# EAGLE design rectifier-monitoring-v2 (EAGLE 6.3)
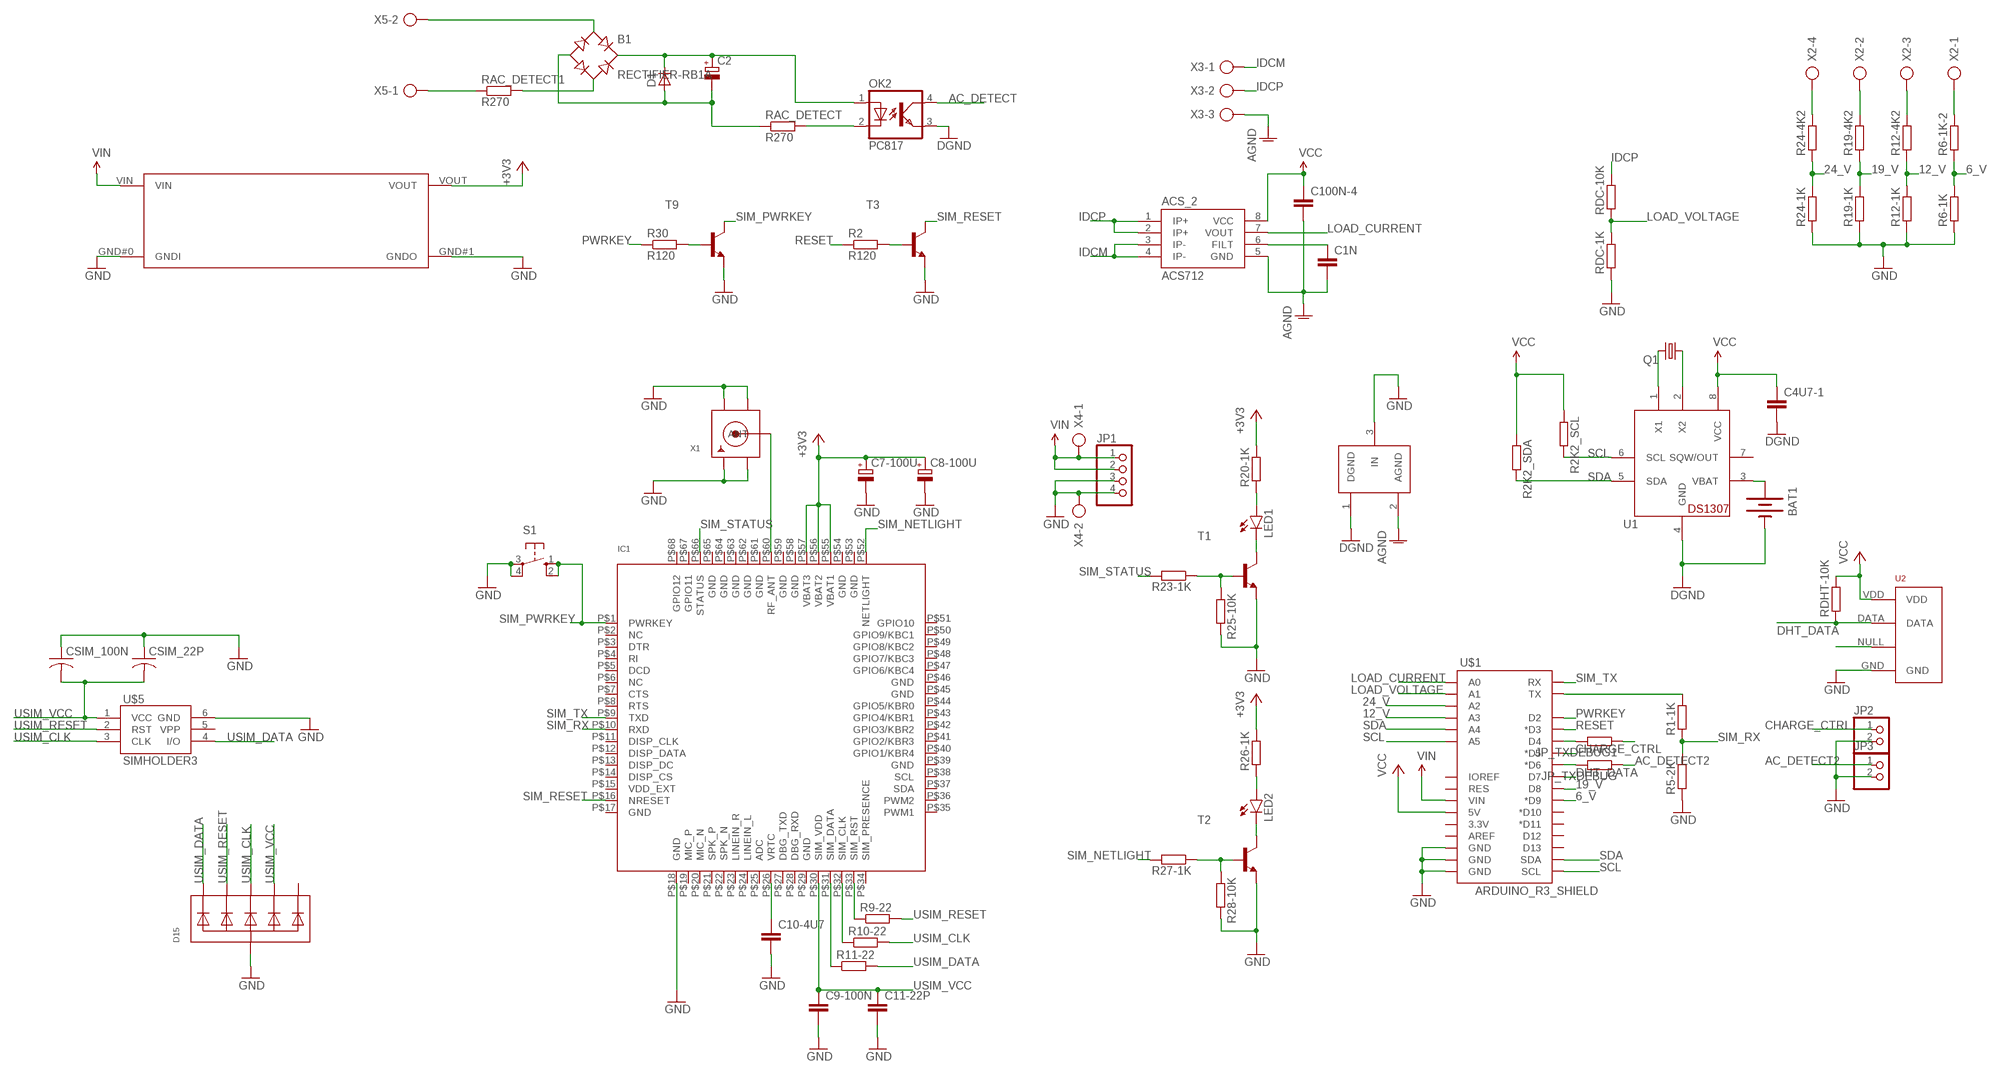
[diagram p0: schematic, sheet 1]

## Parts
ACS_2  ACS712  [SO08]
B1  RECTIFIER-RB1A  [RB1A]
BAT1  BATTERY20PTH  [BATTCOM_20MM_PTH]
C1N  C-EUC0603K  [C0603K]
C2  CPOL-EUE5-8.5  [E5-8,5]
C4U7-1  C-EUC0603K  [C0603K]
C7-100U  CPOL-EU153CLV-0605  [153CLV-0605]
C8-100U  CPOL-EU153CLV-0605  [153CLV-0605]
C9-100N  C-EUC0603  [C0603]
C10-4U7  C-EUC0603  [C0603]
C11-22P  C-EUC0603  [C0603]
C100N-4  C-EUC0603K  [C0603K]
CSIM_22P  C-USC0603K  [C0603K]
CSIM_100N  C-USC0603K  [C0603K]
D1  ZENER-DIODEZD-7.5  [ZDIO-7.5]
D15  TVSARRAY_5LANE  [SOT363]
IC1  GSM_SIM900_LITERAL  [SIM900_SMT]
JP1  PINHD-1X4  [1X04]
JP2  PINHD-1X2  [1X02]
JP3  PINHD-1X2  [1X02]
JP_TXDEBUG  R-EU_R0603  [R0603]
JP_TXDEBUG1  R-EU_R0603  [R0603]
LED1  LED-3MM-NO_SILK  [LED3MM-NS]
LED2  LED-3MM-NO_SILK  [LED3MM-NS]
OK2  PC817  [DIL04]
Q1  CRYSTALTC38H  [TC38H]
R1-1K  R-EU_R0603  [R0603]
R2  R120  R-EU_M0805  [M0805]
R2K2_SCL  R-EU_R0603  [R0603]
R2K2_SDA  R-EU_R0603  [R0603]
R5-2K  R-EU_R0603  [R0603]
R6-1K  R-EU_R0805  [R0805]
R6-1K-2  R-EU_R0805  [R0805]
R9-22  R-EU_R0603  [R0603]
R10-22  R-EU_R0603  [R0603]
R11-22  R-EU_R0603  [R0603]
R12-1K  R-EU_R0805  [R0805]
R12-4K2  R-EU_R0805  [R0805]
R19-1K  R-EU_R0805  [R0805]
R19-4K2  R-EU_R0805  [R0805]
R20-1K  R-EU_R0603  [R0603]
R23-1K  R-EU_R0603  [R0603]
R24-1K  R-EU_R0805  [R0805]
R24-4K2  R-EU_R0805  [R0805]
R25-10K  R-EU_R0603  [R0603]
R26-1K  R-EU_R0603  [R0603]
R27-1K  R-EU_R0603  [R0603]
R28-10K  R-EU_R0603  [R0603]
R30  R120  R-EU_M0805  [M0805]
RAC_DETECT  R270  R-EU_R0603  [R0603]
RAC_DETECT1  R270  R-EU_0207/10  [0207/10]
RDC-1K  R-EU_M0805  [M0805]
RDC-10K  R-EU_R0805  [R0805]
RDHT-10K  R-EU_R0603  [R0603]
S1  10-XX  [B3F-10XX]
T1  MMBT2222ALT1-NPN-SOT23-BEC  [SOT23-BEC]
T2  MMBT2222ALT1-NPN-SOT23-BEC  [SOT23-BEC]
T3  MMBT2222ALT1-NPN-SOT23-BEC  [SOT23-BEC]
T9  MMBT2222ALT1-NPN-SOT23-BEC  [SOT23-BEC]
U1  DS1307  [DIL08]
U2  RHT03_DHT-22_AM2302  [RHT03_DHT-22]
U$1  ARDUINO_R3_SHIELD  [UNO_R3_SHIELD]
U$2  DCDCMODULE  [DCDCMODULE]
U$3  GND_CONNECT  [GND_CONNECT]
U$5  SIMHOLDER3  [SIMHOLDER3]
X1  SMACONNECTOR  [SMA90_DIP]
X2  AK300/4  [AK300/4]
X3  AK300/3  [AK300/3]
X4  AK300/2  [AK300/2]
X5  AK300/2  [AK300/2]

## Nets
6_V: R6-1K-2.1 R6-1K.2 U$1.D9(*D9)
12_V: R12-1K.2 R12-4K2.1 U$1.A3
19_V: R19-1K.2 R19-4K2.1 U$1.D8
24_V: R24-1K.2 R24-4K2.1 U$1.A2
+3V3: C7-100U.+ C8-100U.+ IC1.P$55(VBAT1) IC1.P$56(VBAT2) IC1.P$57(VBAT3) R20-1K.2 R26-1K.2 U$2.VOUT
AC_DETECT: JP_TXDEBUG1.1 OK2.4(COL)
AC_DETECT2: JP3.1 JP_TXDEBUG.1
AGND: ACS_2.5(GND) C1N.2 C100N-4.2 U$3.2(AGND) X3.3
CHARGE_CTRL: JP2.1 U$1.D5(*D5)
DHT_DATA: RDHT-10K.1 U2.DATA U$1.D7
GND: BAT1.2(-) C4U7-1.2 C7-100U.- C8-100U.- C9-100N.2 C10-4U7.2 C11-22P.2 CSIM_22P.1 CSIM_100N.1 D15.2(A) IC1.P$18(GND) JP1.3 JP1.4 JP2.2 JP3.2 OK2.3(EMIT) R5-2K.1 R6-1K.1 R12-1K.1 R19-1K.1 R24-1K.1 R25-10K.2 R28-10K.2 RDC-1K.1 S1.3(P) S1.4(P1) T1.E T2.E T3.E T9.E U1.4(GND) U2.GND U$1.GND@0(GND) U$1.GND@1(GND) U$1.GND@2(GND) U$2.GND#0(GNDI) U$2.GND#1(GNDO) U$3.1(DGND) U$3.3(IN) U$5.6(GND) X1.GND1 X1.GND2 X1.GND3 X1.GND4 X4.2 ; supply symbol labelled DGND
IDCM: ACS_2.3(IP-) ACS_2.4(IP-) X3.1
IDCP: ACS_2.1(IP+) ACS_2.2(IP+) RDC-10K.2 X3.2
LOAD_CURRENT: ACS_2.7(VOUT) U$1.A0
LOAD_VOLTAGE: RDC-1K.2 RDC-10K.1 U$1.A1
N$1: B1.AC2 RAC_DETECT1.2
N$2: IC1.P$31(SIM_DATA) R11-22.1
N$3: IC1.P$32(SIM_CLK) R10-22.1
N$4: IC1.P$33(SIM_RST) R9-22.1
N$5: C10-4U7.1 IC1.P$26(VRTC)
N$6: IC1.P$60(RF_ANT) X1.ANTENNA(ANT)
N$7: R1-1K.2 U$1.TX
N$8: LED1.A R20-1K.1
N$9: LED1.K(C) T1.C
N$10: R23-1K.1 R25-10K.1 T1.B
N$11: LED2.A R26-1K.1
N$12: LED2.K(C) T2.C
N$13: R27-1K.1 R28-10K.1 T2.B
N$14: R30.2 T9.B
N$15: R2.2 T3.B
N$16: Q1.2 U1.1(X1)
N$17: R12-4K2.2 X2.3
N$18: R24-4K2.2 X2.4
N$19: Q1.1 U1.2(X2)
N$20: B1.AC1 X5.2
N$21: ACS_2.6(FILT) C1N.1
N$22: RAC_DETECT1.1 X5.1
N$23: BAT1.1(+) U1.3(VBAT)
N$24: R19-4K2.2 X2.2
N$25: B1.+ C2.+ D1.C OK2.1(A)
N$26: OK2.2(C) RAC_DETECT.2
N$28: B1.- C2.- D1.A RAC_DETECT.1
N$30: JP_TXDEBUG.2 U$1.D6(*D6)
N$31: JP_TXDEBUG1.2 U$1.D4
N$32: U2.NULL
N$35: R6-1K-2.2 X2.1
PWRKEY: R30.1 U$1.D2
RESET: R2.1 U$1.D3(*D3)
SCL: R2K2_SCL.2 U1.6(SCL) U$1.A5 U$1.SCL
SDA: R2K2_SDA.2 U1.5(SDA) U$1.A4 U$1.SDA
SIM_NETLIGHT: IC1.P$52(NETLIGHT) R27-1K.2
SIM_PWRKEY: IC1.P$1(PWRKEY) S1.1(S) S1.2(S1) T9.C
SIM_RESET: IC1.P$16(NRESET) T3.C
SIM_RX: IC1.P$10(RXD) R1-1K.1 R5-2K.2
SIM_STATUS: IC1.P$66(STATUS) R23-1K.2
SIM_TX: IC1.P$9(TXD) U$1.RX
USIM_CLK: D15.4(C3) R10-22.2 U$5.3(CLK)
USIM_DATA: D15.1(C1) R11-22.2 U$5.4(I/O)
USIM_RESET: D15.3(C2) R9-22.2 U$5.2(RST)
USIM_VCC: C9-100N.1 C11-22P.1 CSIM_22P.2 CSIM_100N.2 D15.5(C4) IC1.P$30(SIM_VDD) U$5.1(VCC)
VCC: ACS_2.8(VCC) C4U7-1.1 C100N-4.1 R2K2_SCL.1 R2K2_SDA.1 RDHT-10K.2 U1.8(VCC) U2.VDD U$1.5V
VIN: JP1.1 JP1.2 U$1.VIN U$2.VIN X4.1
Unconnected: D15.6(C5) IC1.P$2(NC) IC1.P$3(DTR) IC1.P$4(RI) IC1.P$5(DCD) IC1.P$6(NC) IC1.P$7(CTS) IC1.P$8(RTS) IC1.P$11(DISP_CLK) IC1.P$12(DISP_DATA) IC1.P$13(DISP_DC) IC1.P$14(DISP_CS) IC1.P$15(VDD_EXT) IC1.P$19(MIC_P) IC1.P$20(MIC_N) IC1.P$21(SPK_P) IC1.P$22(SPK_N) IC1.P$23(LINEIN_R) IC1.P$24(LINEIN_L) IC1.P$25(ADC) IC1.P$27(DBG_TXD) IC1.P$28(DBG_RXD) IC1.P$34(SIM_PRESENCE) IC1.P$35(PWM1) IC1.P$36(PWM2) IC1.P$37(SDA) IC1.P$38(SCL) IC1.P$40(GPIO1/KBR4) IC1.P$41(GPIO2/KBR3) IC1.P$42(GPIO3/KBR2) IC1.P$43(GPIO4/KBR1) IC1.P$44(GPIO5/KBR0) IC1.P$47(GPIO6/KBC4) IC1.P$48(GPIO7/KBC3) IC1.P$49(GPIO8/KBC2) IC1.P$50(GPIO9/KBC1) IC1.P$51(GPIO10) U1.7(SQW/OUT) U$1.3.3V U$1.AREF U$1.D10(*D10) U$1.D11(*D11) U$1.D12 U$1.D13 U$1.IOREF U$1.RES U$5.5(VPP)

## Power pins joined to a net without a drawn wire
GND: IC1.P$17(GND) IC1.P$29(GND) IC1.P$39(GND) IC1.P$45(GND) IC1.P$46(GND) IC1.P$53(GND) IC1.P$54(GND) IC1.P$58(GND) IC1.P$59(GND) IC1.P$61(GND) IC1.P$62(GND) IC1.P$63(GND) IC1.P$64(GND) IC1.P$65(GND)
GPIO11: IC1.P$67(GPIO11)
GPIO12: IC1.P$68(GPIO12)

## Library data of the parts
ACS_2 = SparkFun:ACS712
B1 = rectifier:RECTIFIER-: Rectifier
BAT1 = SparkFun-Electromechanical:BATTERY: Battery Holders Various common sizes : AA, AAA, 20mm coin cell and 12mm coin cell. 20MM_4LEGS, BATT-10373
C1N C4U7-1 C9-100N C10-4U7 C11-22P C100N-4 = rcl:C-EU: CAPACITOR, European symbol
C2 C7-100U C8-100U = rcl:CPOL-EU: POLARIZED CAPACITOR, European symbol
CSIM_22P CSIM_100N = rcl:C-US: CAPACITOR, American symbol
D1 = diode:ZENER-DIODE: Z-Diode
D15 = microbuilder:TVSARRAY_5LANE: Voltage Transient Suppressor Array SOT363 SMF05C - 100W 5V: Digikey - SMF05CT1GOSCT-ND
IC1 = microbuilder:GSM_SIM900_LITERAL: SIM900 Quad-Band GSM/GPRS Module Power Supply: 3.2-4.8V Temperature Range: -30°C-+80°C Bands: GSM 850, EGSM 900, DCS 1800, PCS 1900
JP1 = pinhead:PINHD-1X4: PIN HEADER
JP2 JP3 = pinhead:PINHD-1X2: PIN HEADER
JP_TXDEBUG JP_TXDEBUG1 R1-1K R2K2_SCL R2K2_SDA R5-2K R6-1K R6-1K-2 R9-22 R10-22 R11-22 R12-1K R12-4K2 R19-1K R19-4K2 R20-1K R23-1K R24-1K R24-4K2 R25-10K R26-1K R27-1K R28-10K RDC-1K RDC-10K RDHT-10K = rcl:R-EU_: RESISTOR, European symbol
LED1 LED2 = SparkFun-LED:LED: LEDs Standard schematic elements and footprints for 5mm, 3mm, 1206, and 0603 sized LEDs. 5mm - Spark Fun Electronics SKU : COM-00529 (and others)
OK2 = optocoupler:PC817: SHARP OPTO COUPLER; MPN: PC817X4J000F; OC_FARNELL: 9707727; OC_NEWARK: 97K7059
Q1 = crystal:CRYSTAL: CRYSTAL; OC_FARNELL: unknown; OC_NEWARK: unknown
R2 R30 RAC_DETECT RAC_DETECT1 = resistor:R-EU_: RESISTOR, European symbol
S1 = switch-omron:10-XX: OMRON SWITCH; MPN: B3F-1000; OC_FARNELL: 176432; OC_NEWARK: 36M3542
T1 T2 = transistor:*-NPN-: NPN Transistror BF959 corrected 2008.03.06
T3 T9 = transistor-neu-to92:*-NPN-: NPN Transistror BF959 corrected 2008.03.06
U1 = adafruit:DS1307: DS1307 Real time clock (RTC) with battery backup ability. Talk to it via i2c
U2 = RHT03_DHT-22_AM2302:RHT03_DHT-22_AM2302: RHT03 / DHT-22 / AM2302 Packages and symbol for the RHT03 / DHT-22 relative humidity and temperature sensor. Note: The AM2302 is a wired version of the DHT-22 which typically requires less clearance and is thus provided as a separate package.; PROD_ID: SEN-10167
U$1 = SparkFun-Boards:ARDUINO_R3_SHIELD: Shield form compatible with the Arduino Uno R3.
U$2 = bontor:DCDCMODULE
U$3 = SparkFun-Passives:GND_CONNECT: Use to make a connection of multiple grounds in only one place.
U$5 = SparkFun:SIMHOLDER3
X1 = microbuilder:SMACONNECTOR: SMA Connector 90° DIP SMA Connector, 50 Ohm (4UConnector: 07259)
X2 = con-ptr500:AK300/4: CONNECTOR; OC_FARNELL: unknown; OC_NEWARK: unknown
X3 = con-ptr500:AK300/3: CONNECTOR; OC_FARNELL: unknown; OC_NEWARK: unknown
X4 X5 = con-ptr500:AK300/2: CONNECTOR; OC_FARNELL: unknown; OC_NEWARK: unknown

## Board
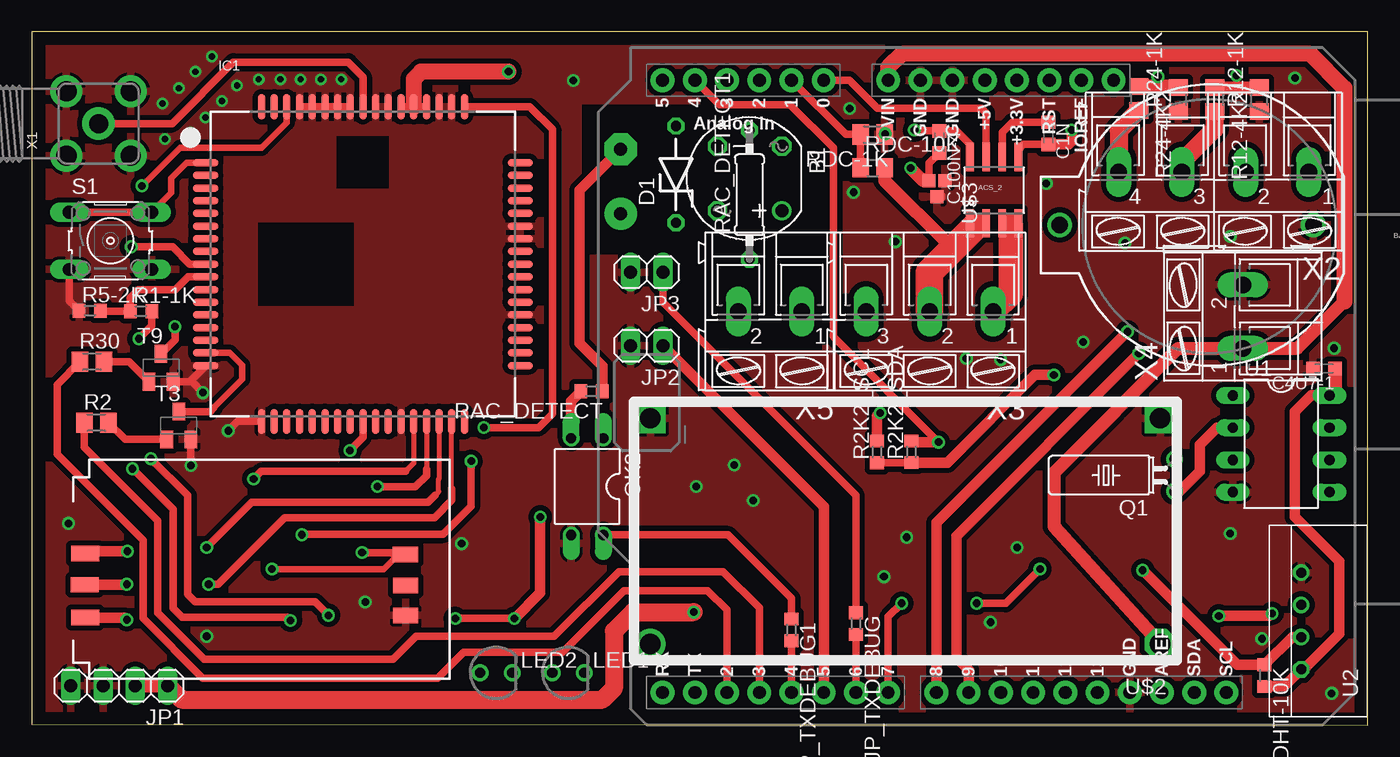
[diagram p1: board, top side]
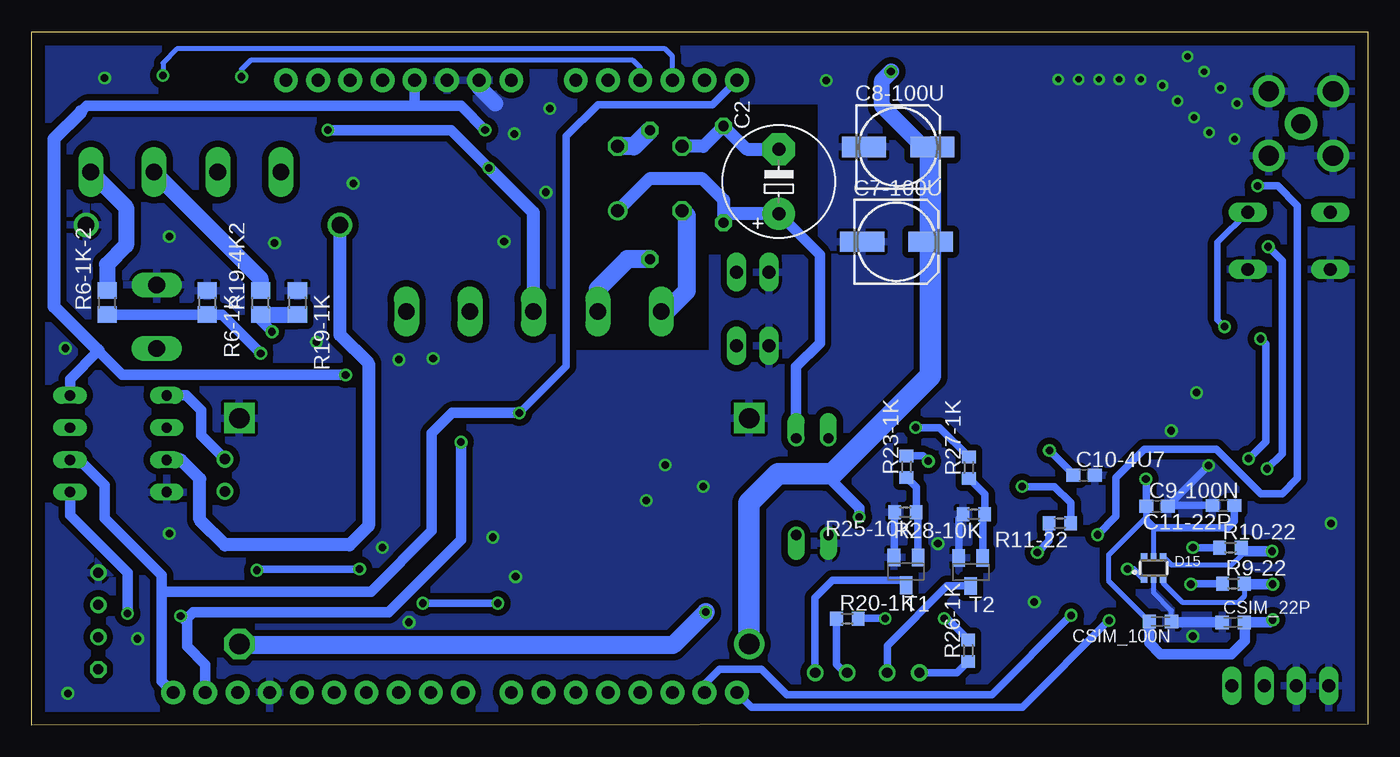
[diagram p2: board, bottom side, seen from below]

Size 105.35 x 54.65 mm. Coordinates in mm from the lower left corner, seen from the top.
Outline: 0,0.05 105.35,0 105.35,54.65 0,54.65 0,0.05
Copper layers (1*16): Top 0.035mm / dielectric 1.5mm / Bottom 0.035mm
Design rules "default": minimum track width 10mil, minimum drill 24mil, track to track 8mil, track to pad 8mil, pad to pad 8mil, via to via 8mil, smd to smd 8mil, copper to edge 40mil, drill to drill 8mil, minimum pad ring 10mil, minimum via ring 8mil, stop-mask expansion 4mil, vias tented up to drill 0mil, thermal gap 10mil

### Footprints (pad centres in the part's own frame; a part is rotated, then mirrored left to right if it is on the bottom)
SO08 = smd 0.61 x 2.21: 1 -1.905,-2.616; 2 -0.635,-2.616; 3 0.635,-2.616; 4 1.905,-2.616; 5 1.905,2.616; 6 0.635,2.616; 7 -0.635,2.616; 8 -1.905,2.616
RB1A = drill 1.016: + -2.54,2.54 | drill 1.016 octagon: - 2.54,-2.54; AC1 2.54,2.54; AC2 -2.54,-2.54
BATTCOM_20MM_PTH = drill 1.3: 1 11.85,0; 2 -8.15,0
C0603K = smd 1.05 x 1.08: 1 -0.875,0; 2 0.875,0
E5-8,5 = drill 1.016 pad 2.54: + -2.54,0 | drill 1.016 pad 2.54 octagon: - 2.54,0
153CLV-0605 = smd 3.5 x 1.6: + 2.7,0; - -2.7,0
C0603 = smd 1.1 x 1: 1 -0.85,0; 2 0.85,0
ZDIO-7.5 = drill 0.813 octagon: A 3.81,0; C -3.81,0
SOT363 = smd 0.5 x 0.5: 1 -0.75,-0.9; 3 0.75,-0.9; 4 0.75,0.9; 6 -0.75,0.9 | smd 0.4 x 0.5: 2 0,-0.9; 5 0,0.9
SIM900_SMT = smd 2 x 0.6: P$1 -12.4,8; P$2 -12.4,7; P$3 -12.4,6; P$4 -12.4,5; P$5 -12.4,4; P$6 -12.4,3; P$7 -12.4,2; P$8 -12.4,1; P$9 -12.4,0; P$10 -12.4,-1; P$11 -12.4,-2; P$12 -12.4,-3; P$13 -12.4,-4; P$14 -12.4,-5; P$15 -12.4,-6; P$16 -12.4,-7; P$17 -12.4,-8; P$35 12.4,-8; P$36 12.4,-7; P$37 12.4,-6; P$38 12.4,-5; P$39 12.4,-4; P$40 12.4,-3; P$41 12.4,-2; P$42 12.4,-1; P$43 12.4,0; P$44 12.4,1; P$45 12.4,2; P$46 12.4,3; P$47 12.4,4; P$48 12.4,5; P$49 12.4,6; P$50 12.4,7; P$51 12.4,8 | smd 0.6 x 2: P$18 -8,-12.4; P$19 -7,-12.4; P$20 -6,-12.4; P$21 -5,-12.4; P$22 -4,-12.4; P$23 -3,-12.4; P$24 -2,-12.4; P$25 -1,-12.4; P$26 0,-12.4; P$27 1,-12.4; P$28 2,-12.4; P$29 3,-12.4; P$30 4,-12.4; P$31 5,-12.4; P$32 6,-12.4; P$33 7,-12.4; P$34 8,-12.4; P$52 8,12.4; P$53 7,12.4; P$54 6,12.4; P$55 5,12.4; P$56 4,12.4; P$57 3,12.4; P$58 2,12.4; P$59 1,12.4; P$60 0,12.4; P$61 -1,12.4; P$62 -2,12.4; P$63 -3,12.4; P$64 -4,12.4; P$65 -5,12.4; P$66 -6,12.4; P$67 -7,12.4; P$68 -8,12.4
1X04 = drill 1.016 long: 1 -3.81,0; 2 -1.27,0; 3 1.27,0; 4 3.81,0
1X02 = drill 1.016 long: 1 -1.27,0; 2 1.27,0
R0603 = smd 1 x 1.1: 1 -0.85,0; 2 0.85,0
LED3MM-NS = drill 0.813: A -1.27,0; K 1.27,0
DIL04 = drill 0.813 offset: 1 -1.27,-3.81; 2 1.27,-3.81; 3 1.27,3.81; 4 -1.27,3.81
TC38H = drill 0.813: 1 -1.27,0; 2 1.27,0
M0805 = smd 1.3 x 1.6: 1 -0.95,0; 2 0.95,0
R0805 = smd 1.3 x 1.5: 1 -0.95,0; 2 0.95,0
0207/10 = drill 0.813 octagon: 1 -5.08,0; 2 5.08,0
B3F-10XX = drill 1.016 long: 1 -3.251,2.261; 2 3.251,2.261; 3 -3.251,-2.261; 4 3.251,-2.261
SOT23-BEC = smd 1 x 1.4: B -0.95,-1.1; C 0,1.1; E 0.95,-1.1
DIL08 = drill 0.813 long: 1 -3.81,-3.81; 2 -1.27,-3.81; 3 1.27,-3.81; 4 3.81,-3.81; 5 3.81,3.81; 6 1.27,3.81; 7 -1.27,3.81; 8 -3.81,3.81
RHT03_DHT-22 = drill 0.8: DATA -1.27,0; GND 3.81,0; NULL 1.27,0 | drill 0.8 octagon: VDD -3.81,0
UNO_R3_SHIELD = drill 1.016 pad 1.88: 3.3V 50.8,26.67; 5V 50.8,29.21; A0 50.8,41.91; A1 50.8,44.45; A2 50.8,46.99; A3 50.8,49.53; A4 50.8,52.07; A5 50.8,54.61; AREF 2.54,15.24; D2 2.54,49.53; D3 2.54,46.99; D4 2.54,44.45; D5 2.54,41.91; D6 2.54,39.37; D7 2.54,36.83; D8 2.54,33.02; D9 2.54,30.48; D10 2.54,27.94; D11 2.54,25.4; D12 2.54,22.86; D13 2.54,20.32; GND@0 50.8,31.75; GND@1 50.8,34.29; GND@2 2.54,17.78; IOREF 50.8,21.59; NC 50.8,19.05; RES 50.8,24.13; RX 2.54,54.61; SCL 2.54,10.16; SDA 2.54,12.7; TX 2.54,52.07; VIN 50.8,36.83
DCDCMODULE = drill 1.6 square: GND#0 1.7,1.7; GND#1 41.9,1.7 | drill 1.6 octagon: VIN 1.7,19.5 | drill 1.6: VOUT 41.9,19.5
GND_CONNECT = smd 1.016 x 1.016: 1 -1.016,0; 2 -1.016,-1.27; 3 0.254,-0.635
SIMHOLDER3 = smd 2.2 x 1.2: 1 0.95,4.81; 2 0.91,7.41; 3 0.95,9.86 | smd 2 x 1.2: 4 26.2,9.78; 5 26.22,7.34; 6 26.22,4.98
SMA90_DIP = drill 1.5 pad 2.54: ANTENNA 0,0 | drill 1.6 pad 2.54: GND1 -2.54,2.54; GND2 2.54,2.54; GND3 -2.54,-2.54; GND4 2.54,-2.54
AK300/4 = drill 1.321 long: 1 -7.493,0; 2 -2.515,0; 3 2.515,0; 4 7.493,0
AK300/3 = drill 1.321 long: 1 -5.004,0; 2 0,0; 3 5.004,0
AK300/2 = drill 1.321 long: 1 -2.515,0; 2 2.489,0

### Placement (x,y rotation side)
ACS_2  75.89,42.16 0 top
B1  56.61,43.08 180 top
BAT1  92.91,39.42 180 top
C1N  80.17,46.64 270 top
C2  46.44,42.85 90 bottom
C4U7-1  101.9,28.1 180 top
C7-100U  37.17,38.09 0 bottom
C8-100U  37.03,45.57 0 bottom
C9-100N  16.62,17.24 0 bottom
C10-4U7  22.38,19.69 0 bottom
C11-22P  11.39,17.31 180 bottom
C100N-4  71.57,45.96 270 top
CSIM_22P  10.61,8.09 0 bottom
CSIM_100N  16.35,8.16 180 bottom
D1  50.8,43.4 90 top
D15  16.89,12.38 0 bottom
IC1  26.12,36.33 0 top
JP1  6.9,3.1 180 top
JP2  48.5,29.9 180 top
JP3  48.5,35.7 180 top
JP_TXDEBUG  65,8 270 top
JP_TXDEBUG1  59.9,7.5 270 top
LED1  42.31,4.13 0 top
LED2  36.62,4.13 0 top
OK2  43.8,18.8 180 top
Q1  90.11,19.69 90 top
R1-1K  8.63,32.63 0 top
R2  5.1,23.83 0 top
R2K2_SCL  66.66,21.53 90 top
R2K2_SDA  69.36,21.54 90 top
R5-2K  4.58,32.67 0 top
R6-1K  91.5,33.3 270 bottom
R6-1K-2  99.4,33.3 90 bottom
R9-22  10.59,11.14 0 bottom
R10-22  10.83,13.99 0 bottom
R11-22  24.28,15.91 180 bottom
R12-1K  96.8,49.3 90 top
R12-4K2  93.3,49.3 270 top
R19-1K  84.4,33.3 270 bottom
R19-4K2  87.3,33.3 90 bottom
R20-1K  41.04,8.38 0 bottom
R23-1K  36.37,20.36 90 bottom
R24-1K  90.4,49.3 90 top
R24-4K2  87.3,49.4 270 top
R25-10K  36.46,16.79 180 bottom
R26-1K  31.51,5.86 90 bottom
R27-1K  31.46,20.29 90 bottom
R28-10K  31.06,16.63 180 bottom
R30  4.75,28.64 0 top
RAC_DETECT  44.15,26.31 180 top
RAC_DETECT1  56.6,41.8 90 top
RDC-1K  66.3,46.55 180 top
RDC-10K  66.3,43.91 0 top
RDHT-10K  97.2,3.9 270 top
S1  6.21,38.17 0 top
T1  36.41,12.11 180 bottom
T2  31.31,12.07 180 bottom
T3  11.6,23.61 0 top
T9  10.2,28.16 0 top
U1  98.52,22.17 270 top
U2  100.1,8.2 90 top
U$1  104.36,0.03 90 top
U$2  90.68,25.89 180 top
U$3  72.02,41.9 270 top
U$5  3.26,3.66 0 top
X1  5.27,47.41 90 top
X2  93.2,43.6 180 top
X3  70.8,32.6 180 top
X4  95.5,32.2 90 top
X5  58.2,32.6 180 top

### Tracks (layer width: path | path; a pad name or v marks a point on that pad's centre or on a via)
6_V  (via drill 0.6)
  Top 0.813: v87.3,29.3 72.9,14.9 72.9,5.3 73.88,4.32 U$1.D9
  Bottom 0.813: v87.3,29.3 90.35,32.35 R6-1K.2 R6-1K-2.1
12_V  (via drill 0.6)
  Top 0.406: v95,51.2 95,50.25
  Top 1.016: R12-4K2.1 95,50.25 R12-1K.2
  Bottom 0.406: v95,51.2 95,52.2 93.9,53.3 55.4,53.3 54.83,52.73 U$1.A3
19_V  (via drill 0.6)
  Top 0.813: U$1.D8 71.34,15.94 v86.4,31
  Bottom 0.813: v86.4,31 87.3,31.9 R19-4K2.1
  Bottom 1.27: R19-4K2.1 R19-1K.2
24_V  (via drill 0.6)
  Top 0.406: v88.8,51.1 88.8,50.35
  Top 1.016: R24-1K.2 90.3,50.35 88.8,50.35 R24-4K2.1
  Bottom 0.406: v88.8,51.1 88.8,51.7 88.1,52.4 57.94,52.4 57.37,51.83 U$1.A2
+3V3  (via drill 0.6)
  Top 0.61: v33.4,8.4 v38.05,8.4 | IC1.P$57 IC1.P$56 IC1.P$55
  Top 0.813: v38.05,8.4 38.07,8.38 40.1,10.41 v40.1,16.4
  Top 1.27: v37.6,51.5 30.7,51.5 30.12,50.92 IC1.P$56
  Bottom 0.61: R26-1K.2 33.2,8.4 v33.4,8.4 | v38.05,8.4 40.17,8.4 R20-1K.2
  Bottom 0.813: v40.1,16.4 40.1,17.1 42.8,19.8
  Bottom 1.27: C8-100U.+ 35.07,45.57 38.3,48.8 38.3,50.8 v37.6,51.5
  Bottom 1.676: C8-100U.+ 34.47,45.43 C7-100U.+ 34.47,27.53 42.2,19.8 42.8,19.8 46.5,19.8 48.78,17.52 U$2.VOUT
AC_DETECT
  Top 0.61: OK2.4 54.91,14.99 59.91,9.99 59.9,9.98 JP_TXDEBUG1.1
AC_DETECT2
  Top 0.61: JP3.1 49.77,33.33 64.99,18.11 JP_TXDEBUG.1
AGND  (via drill 0.6)
  Top 0.61: U$3.2 70.75,44.27 C100N-4.2 | C1N.2 78.21,45.77 77.8,45.35 ACS_2.5
  Top 0.813: C1N.2 81.77,45.77 82,46 v82,46.9
  Top 1.016: 70.3,43 70.67,43 U$3.2 70.28,42.92 v69.3,43.9
  Bottom 0.813: v69.3,43.9 72.3,46.9 v82,46.9
  Bottom 1.016: X3.3 65.8,40.4 v69.3,43.9
CHARGE_CTRL
  Top 0.813: JP2.1 62.45,17.22 U$1.D5
DHT_DATA  (via drill 0.6)
  Top 0.61: v79.5,12.3 76.8,9.6 v74.5,9.6 | U$1.D7 67.53,6.7 67.53,6.93 67.53,8.53 v68.6,9.6
  Top 0.813: v87.6,12.2 95.05,4.75 RDHT-10K.1 99.38,6.93 U2.DATA
  Bottom 0.61: v87.6,12.2 87.5,12.3 v79.5,12.3 | v74.5,9.6 v68.6,9.6
GND  (via drill 0.5, 0.6)
  Top 0.61: IC1.P$65 IC1.P$64 IC1.P$63 IC1.P$62 IC1.P$61 | R5-2K.1 2.96,33.44 S1.3 | IC1.P$17 12.45,27.06 | 12.45,27.06 T9.E | v12.56,20.45 v12.55,20.46 T3.E | IC1.P$18 16.23,23.93 v15.5,23.2 | v13.5,26.2 12.64,27.06 12.45,27.06 | v67.3,46.6 RDC-1K.1
  Top 1.016: 71.55,41.65 U$3.3
  Bottom 0.406: CSIM_100N.1 15.47,9.02 16.89,10.44 D15.2
  Bottom 0.61: T1.E 37.31,13.26 R25-10K.2 | T2.E 32.26,16.28 R28-10K.2 | v12.56,20.45 C9-100N.2 15.7,17.31 C11-22P.2
  Bottom 0.813: CSIM_22P.1 15.4,8.09 CSIM_100N.1
  Bottom 1.27: U$1.GND@1 70.07,50.27 68.8,49
  other vias: 13.8,7 10.3,49 11.6,50.2 12.9,51.5 14.2,52.7 10.5,46.2 12.5,46.7 13.7,47.9 15,49.2 16.2,50.4 17.9,50.9 19.6,50.9 21.2,50.9 22.8,50.9 24.4,50.9 33.9,14.3 102.7,29.7 97,6.8 94.5,15.1 69,14.8 67.2,11.7 75.6,8.1 55.4,20.5 56.9,17.7 52.4,18.8 26.3,9.7 2.9,15.9 42.7,50.8 99.6,51 68.1,38.1 64.8,42 73.7,28.9 76.4,28.8 80,42.7 94.5,38.5 86.2,38 64.5,48.6 77.7,14 82.9,30.2 102.5,2.5
  pour Bottom (isolate 0.5): 1,1.2 1,53.7 104.1,53.6 104.1,1.1
  pour Top (isolate 0.406): 1,1.2 104.1,1.1 104.1,53.6 1,53.7
GNDA
  cutout Top: 18.05,39.6 25.4,39.6 25.4,33.6 25.4,33.05 20.35,33.05 17.85,33.05 17.85,36.65 17.85,39.6
  cutout Top: 24.35,46.4 28.15,46.4 28.15,43.8 28.15,42.3 25.15,42.3 24.05,42.3 24.05,45.35 24.05,46.4
IDCM
  Top 0.61: ACS_2.3 76.67,39.4 77.2,39.4 77.65,39.4 ACS_2.4
  Top 1.93: X3.1 77.2,34 77.2,39.4
IDCP
  Top 0.61: 74.4,39.3 74.16,39.54 ACS_2.1 ACS_2.2
  Top 1.016: RDC-10K.2 67.25,42.91 72.36,37.8 72.9,37.8
  Top 2.184: X3.2 70.8,35.7 72.9,37.8 74.4,39.3
LOAD_CURRENT
  Top 0.61: ACS_2.7 75.25,48.25 74.9,48.6 66.7,48.6 64.47,50.83 U$1.A0
LOAD_VOLTAGE
  Top 0.61: RDC-10K.1 RDC-1K.2 64.19,46.55 U$1.A1
N$1
  Bottom 1.422: RAC_DETECT1.2 57.86,45.62 B1.AC2
N$2  (via drill 0.6)
  Top 0.406: IC1.P$31 31.12,20.17
  Top 0.61: v27.25,18.8 30.25,18.8 31.12,19.67 31.12,20.17
  Bottom 0.61: R11-22.1 23.43,17.53 24.7,18.8 v27.25,18.8
N$3  (via drill 0.6)
  Top 0.406: IC1.P$32 32.12,19.42 32.1,19.4 32.1,18.4 31.8,18.1
  Top 0.61: 31.8,18.1 31.25,17.55 17.35,17.55 v13.8,14
  Bottom 0.61: v13.8,14 v13.79,13.99 R10-22.1
N$4  (via drill 0.6)
  Top 0.406: 33.12,18.62 IC1.P$33
  Top 0.61: 33.12,18.62 33.12,17.72 31.75,16.35 19.95,16.35 14.7,11.1 v13.95,11.1
  Bottom 0.61: 11.48,11.1 R9-22.1 13.56,11.14 v13.95,11.1
N$5  (via drill 0.6)
  Top 0.61: IC1.P$26 26.12,22.67 v25.1,21.65
  Bottom 0.61: v25.1,21.65 23.23,19.78 C10-4U7.1
N$6
  Top 0.61: X1.ANTENNA 11.06,47.41 15.9,52.25 24.95,52.25 26.12,51.08 IC1.P$60
N$7  (via drill 0.6)
  Top 0.61: R1-1K.2 9.48,31.48 v8.45,30.45 | v9.4,21 12.3,18.1 12.3,10.3 12.9,9.7 22.35,9.7 v23.4,8.65
  Bottom 0.61: v8.45,30.45 8.05,30.05 8.05,22.35 v9.4,21 | v23.4,8.65 29.65,2.4 45.8,2.4 47.8,4.4 51.1,4.4 52.3,3.2 52.29,3.19 U$1.TX
N$8
  Bottom 0.61: R20-1K.1 41.89,4.78 41.24,4.13 LED1.A
N$9
  Bottom 0.61: T1.C 36.8,11.4 42.2,11.4 43.58,10.02 LED1.K
N$10
  Bottom 0.61: T1.B 35.46,16.64 R25-10K.1 35.61,18.75 R23-1K.1
N$11
  Bottom 0.61: R26-1K.1 32.39,4.13 LED2.A
N$12
  Bottom 0.61: T2.C 33.18,10.97 37.89,6.26 LED2.K
N$13
  Bottom 0.61: R27-1K.1 30.21,18.19 R28-10K.1 30.36,16.48 T2.B
N$14
  Top 0.61: R30.2 7.67,28.64 T9.B
N$15
  Top 0.61: T3.B 7.37,22.51 R2.2
N$16
  Bottom 0.813: Q1.2 92,22.85 92,24.8 93.18,25.98 U1.1
N$17
  Top 1.422: R12-4K2.2 93.3,47 90.69,44.39 X2.3
N$18
  Top 1.422: R24-4K2.2 85.71,46.86 X2.4
N$19
  Top 0.813: U1.2 93.44,23.44 92.1,22.1 92.1,20 90.52,18.42 Q1.1
N$20
  Bottom 1.422: B1.AC1 53.7,40.17 53.7,34.2 55.3,32.6 X5.2
N$21
  Top 0.61: ACS_2.6 76.53,46.73 77.31,47.52 C1N.1
N$22
  Bottom 1.27: X5.1 60.72,34.38
  Bottom 1.422: RAC_DETECT1.1 58.37,36.72 60.72,34.38
N$23
  Bottom 1.016: U1.3 93.6,20.9 92.1,19.4 92.1,16.2 90.1,14.2 80.3,14.2 78.8,15.7 78.8,28.5 81.06,30.76 BAT1.1
N$24
  Bottom 1.27: X2.2 87.3,35.19 R19-4K2.2
N$25
  Bottom 0.813: C2.+ 43.2,37.07 43.2,30.1 45.07,28.23 OK2.1
  Bottom 1.016: B1.+ 56.59,43.1 52.5,43.1 50.8,41.4 D1.C 50.8,40.31 C2.+
N$26
  Top 0.813: RAC_DETECT.2 42.53,25.54 OK2.2
N$27
  cutout Bottom: 43.4,48.9 62.3,48.9 62.3,29.6 52,29.6 52,37.1 43.4,37.1
N$28
  Top 0.813: RAC_DETECT.1 45,28.3 43.2,30.1 43.2,42.15 C2.-
  Bottom 1.016: B1.- 52.39,45.62 D1.A 48.98,45.39 C2.-
N$29
  cutout Top: 43.4,48.9 62.3,48.9 62.3,29.6 52,29.6 52,37.1 43.4,37.1
N$30
  Top 0.61: U$1.D6 JP_TXDEBUG.2
N$31
  Top 0.61: JP_TXDEBUG1.2 U$1.D4
N$35
  Bottom 1.27: X2.1 97.9,40.81 97.9,37.8 99.4,36.3 R6-1K-2.2
PWRKEY
  Top 0.61: R30.1 2,26.84 2,21.35 8.8,14.55 8.8,8.4 13.5,3.7 32,3.7 34.05,5.75 41.85,5.75 46.7,10.6 53.3,10.6 54.83,9.07 U$1.D2
RESET
  Top 0.61: R2.1 4.15,21.9 9.95,16.1 9.95,8.85 13.6,5.2 28.5,5.2 30.3,7 41.2,7 46.3,12.1 54.5,12.1 57.37,9.23 U$1.D3
SCL  (via drill 0.6)
  Top 0.813: R2K2_SCL.2 66.66,24.36 v66.9,24.6
  Bottom 0.61: v66.9,24.6 63.2,28.3 63.2,46.4 60.7,48.9 51.68,48.9 U$1.A5
  Bottom 0.813: 95.1,10.5 78.6,10.5 73.8,15.3 73.8,23 72.2,24.6 v66.9,24.6 | U$1.SCL 95.1,3.47 95.1,10.5 | 95.1,10.5 95.1,11.8 99.6,16.3 99.6,18.9 101.6,20.9 U1.6
SDA  (via drill 0.6)
  Top 0.61: v71.5,22.3 63.2,30.6 63.2,45.5 59.8,48.9 54.22,48.9 U$1.A4
  Top 0.813: v71.5,22.3 69.36,22.3 R2K2_SDA.2 | v97.8,8.8 97.6,8.6 v93.6,8.6
  Bottom 0.813: v71.5,22.3 71.5,14.6 77.2,8.9 92.6,8.9 93.1,8.4 93.1,8.1 | U$1.SDA 91.66,4.76 93.1,6.2 93.1,8.1 | v93.6,8.6 93.1,8.1 | v97.8,8.8 97.8,12 102.33,16.53 U1.5
SIM_NETLIGHT  (via drill 0.6)
  Top 0.61: IC1.P$52 39.27,48.73 41.05,46.95 41.05,24.55 39.95,23.45 v35.65,23.45
  Bottom 0.61: v35.65,23.45 33.77,23.45 R27-1K.2
SIM_PWRKEY  (via drill 0.6)
  Top 0.5: IC1.P$1 12.23,44.33 11,43.1 11,41.97 S1.2
  Top 0.61: S1.2 S1.1 | T9.C 11.3,30.36 v11.3,31.4
  Bottom 0.5: v11.3,31.4 11.85,31.95 11.85,38.04 S1.2
SIM_RESET
  Top 0.5: 14.36,25.01 16.6,27.25 16.6,28.35 15.62,29.33 IC1.P$16
  Top 0.61: 14.36,25.01 14.06,24.71 T3.C
SIM_RX
  Top 0.61: R5-2K.2 5.47,32.63 R1-1K.1 7.78,33.68 8.4,34.3 11.3,34.3 12.33,35.33 IC1.P$10
SIM_STATUS  (via drill 0.6)
  Top 0.5: IC1.P$66 20.12,47.47 18.15,45.5 11.7,45.5 v8.7,42.5
  Top 0.61: v34.65,20.8 34.65,17.25 32.45,15.05 21.35,15.05 v21.3,15
  Bottom 0.61: v8.7,42.5 7.1,42.5 5.55,40.95 5.55,19.45 6.75,18.25 8.45,18.25 11.95,21.75 17.6,21.75 19.85,19.5 19.85,16.45 v21.3,15 | R23-1K.2 35.06,21.21 v34.65,20.8
SIM_TX  (via drill 0.6)
  Top 0.61: IC1.P$9 12.47,36.33 11.1,37.7 v7.85,37.7 | v7.95,20.2 11.15,17 11.15,9.2 11.85,8.5 20.15,8.5 v20.4,8.25
  Bottom 0.61: v7.95,20.2 6.75,21.4 6.75,36.6 v7.85,37.7 | v20.4,8.25 27.25,1.4 48.58,1.4 U$1.RX
USIM_CLK  (via drill 0.6)
  Top 0.813: U$5.3 4.39,13.7 v7.55,13.7
  Bottom 0.406: R10-22.2 9.95,13.96 9.95,13.4 10.75,12.6 15.46,12.6 D15.4
  Bottom 0.813: v7.55,13.7 9.69,13.7 R10-22.2
USIM_DATA  (via drill 0.6)
  Top 0.5: v18.95,12.3 27.75,12.3 28.73,13.27 28.98,13.52
  Top 0.61: U$5.4 29.06,13.44 28.98,13.52 | v26.05,13.6 28.4,13.6 28.73,13.27
  Bottom 0.5: D15.1 18.46,12.3 v18.95,12.3
  Bottom 0.61: R11-22.2 25.13,14.52 v26.05,13.6
USIM_RESET  (via drill 0.6)
  Top 0.813: U$5.2 7.47,11.07 v7.5,11.1
  Bottom 0.406: R9-22.2 9.75,10.15 10.25,9.65 14.6,9.65 16.14,11.19 D15.3
  Bottom 0.813: v7.5,11.1 9.7,11.1 R9-22.2
USIM_VCC  (via drill 0.6)
  Top 0.406: IC1.P$30 30.12,20.62 29.5,20
  Top 0.61: 29.5,20 18.1,20 v17.5,19.4
  Top 0.813: U$5.1 7.33,8.47 v7.5,8.3
  Bottom 0.406: CSIM_100N.2 20.45,11.38 20.45,13.4 17.47,16.38 C9-100N.1 | D15.5 16.89,15.44 17.38,15.92
  Bottom 0.5: 17.38,15.92 17.47,16.02 17.47,16.15 C9-100N.1
  Bottom 0.61: C11-22P.1 10.54,16.06 11.05,15.55 16.87,15.55 17.47,16.15 | C9-100N.1 17.47,19.37 v17.5,19.4
  Bottom 0.813: v7.5,8.3 7.71,8.09 CSIM_22P.2 9.7,8.05 9.7,6.65 10.75,5.6 16.35,5.6 17.23,6.48 CSIM_100N.2
VCC  (via drill 0.6)
  Top 0.61: R2K2_SCL.1 R2K2_SDA.1 | v69.6,46.9 69.67,46.84 C100N-4.1 72.93,46.84 73.98,45.78 ACS_2.8
  Top 0.813: R2K2_SDA.1 72.19,20.69 79.1,27.6 v80.6,27.6 | RDHT-10K.2 98.76,3.05 U2.VDD 100.3,4.39 103.1,7.19 103.1,12.9 99.6,16.4 99.6,24.7 100.88,25.98 U1.8
  Top 1.016: C4U7-1.1 102.78,26.43 U1.8
  Bottom 0.813: v69.6,46.9 71.5,48.8 75.3,48.8 | 75.3,48.8 101,48.8 101.45,48.35 | U$1.5V 75.15,48.95 75.3,48.8 | v80.6,27.6 98.2,27.6 100.2,29.6 | U1.8 102.33,27.27 100.1,29.5
  Bottom 1.016: 100.1,29.5 100.2,29.6 103.6,33 103.6,46.2 101.45,48.35
VIN  (via drill 0.6)
  Top 1.016: JP1.2 JP1.1 | U$2.VIN 80.6,15.67 80.6,19.9 90.39,29.68 X4.1 99.78,29.68 103.5,33.4
  Top 1.27: 103.5,33.4 103.5,50.2 100.8,52.9 68.6,52.9 67.53,51.83 U$1.VIN
  Top 1.422: JP1.1 11.81,2 45,2 45.9,2.9 45.9,7.4 47.4,8.9 v52.2,8.9
  Bottom 1.422: v52.2,8.9 54.8,6.3 88.89,6.3 U$2.VIN